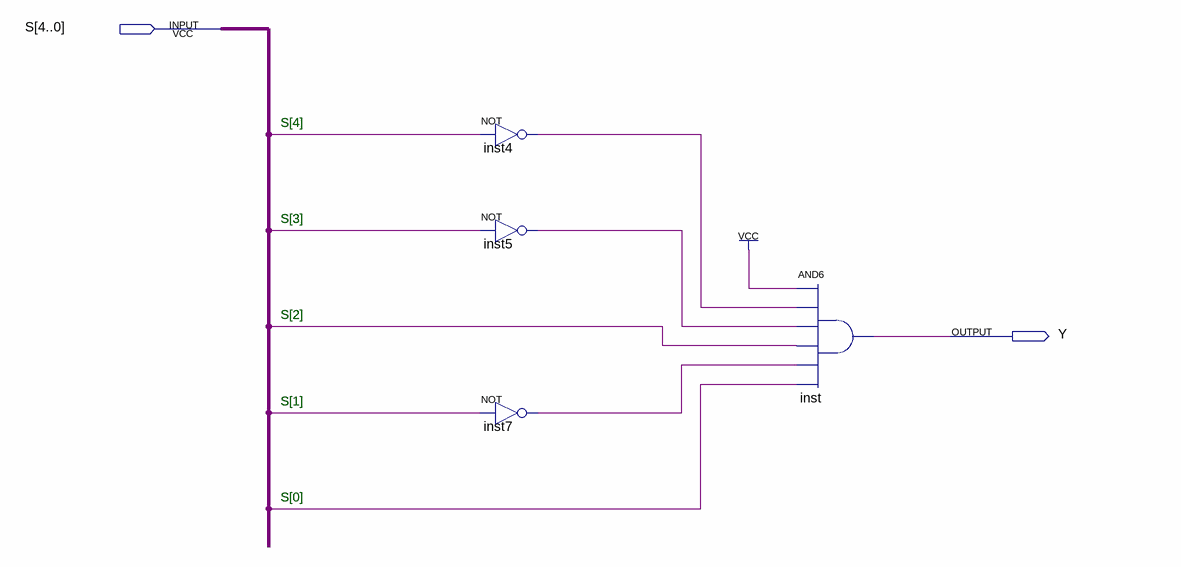
[diagram p0: schematic sheet]
// Quartus schematic S5.bdf as structural Verilog: 4 symbols, 2 pins
module S5 (
  input  [4:0] S,
  output Y
);

  wire inst4_out, inst5_out, inst7_out;

  not inst4 (inst4_out, S[4]);
  not inst5 (inst5_out, S[3]);
  not inst7 (inst7_out, S[1]);
  and inst (Y, 1'b1, inst4_out, inst5_out, S[2], inst7_out, S[0]);

  // Notes on the sheet:
  //   S[4]
  //   S[3]
  //   S[2]
  //   S[1]
  //   S[0]
endmodule
